# EasyEDA schematic RANGKAIAN SISTEM KESELURUHAN.json
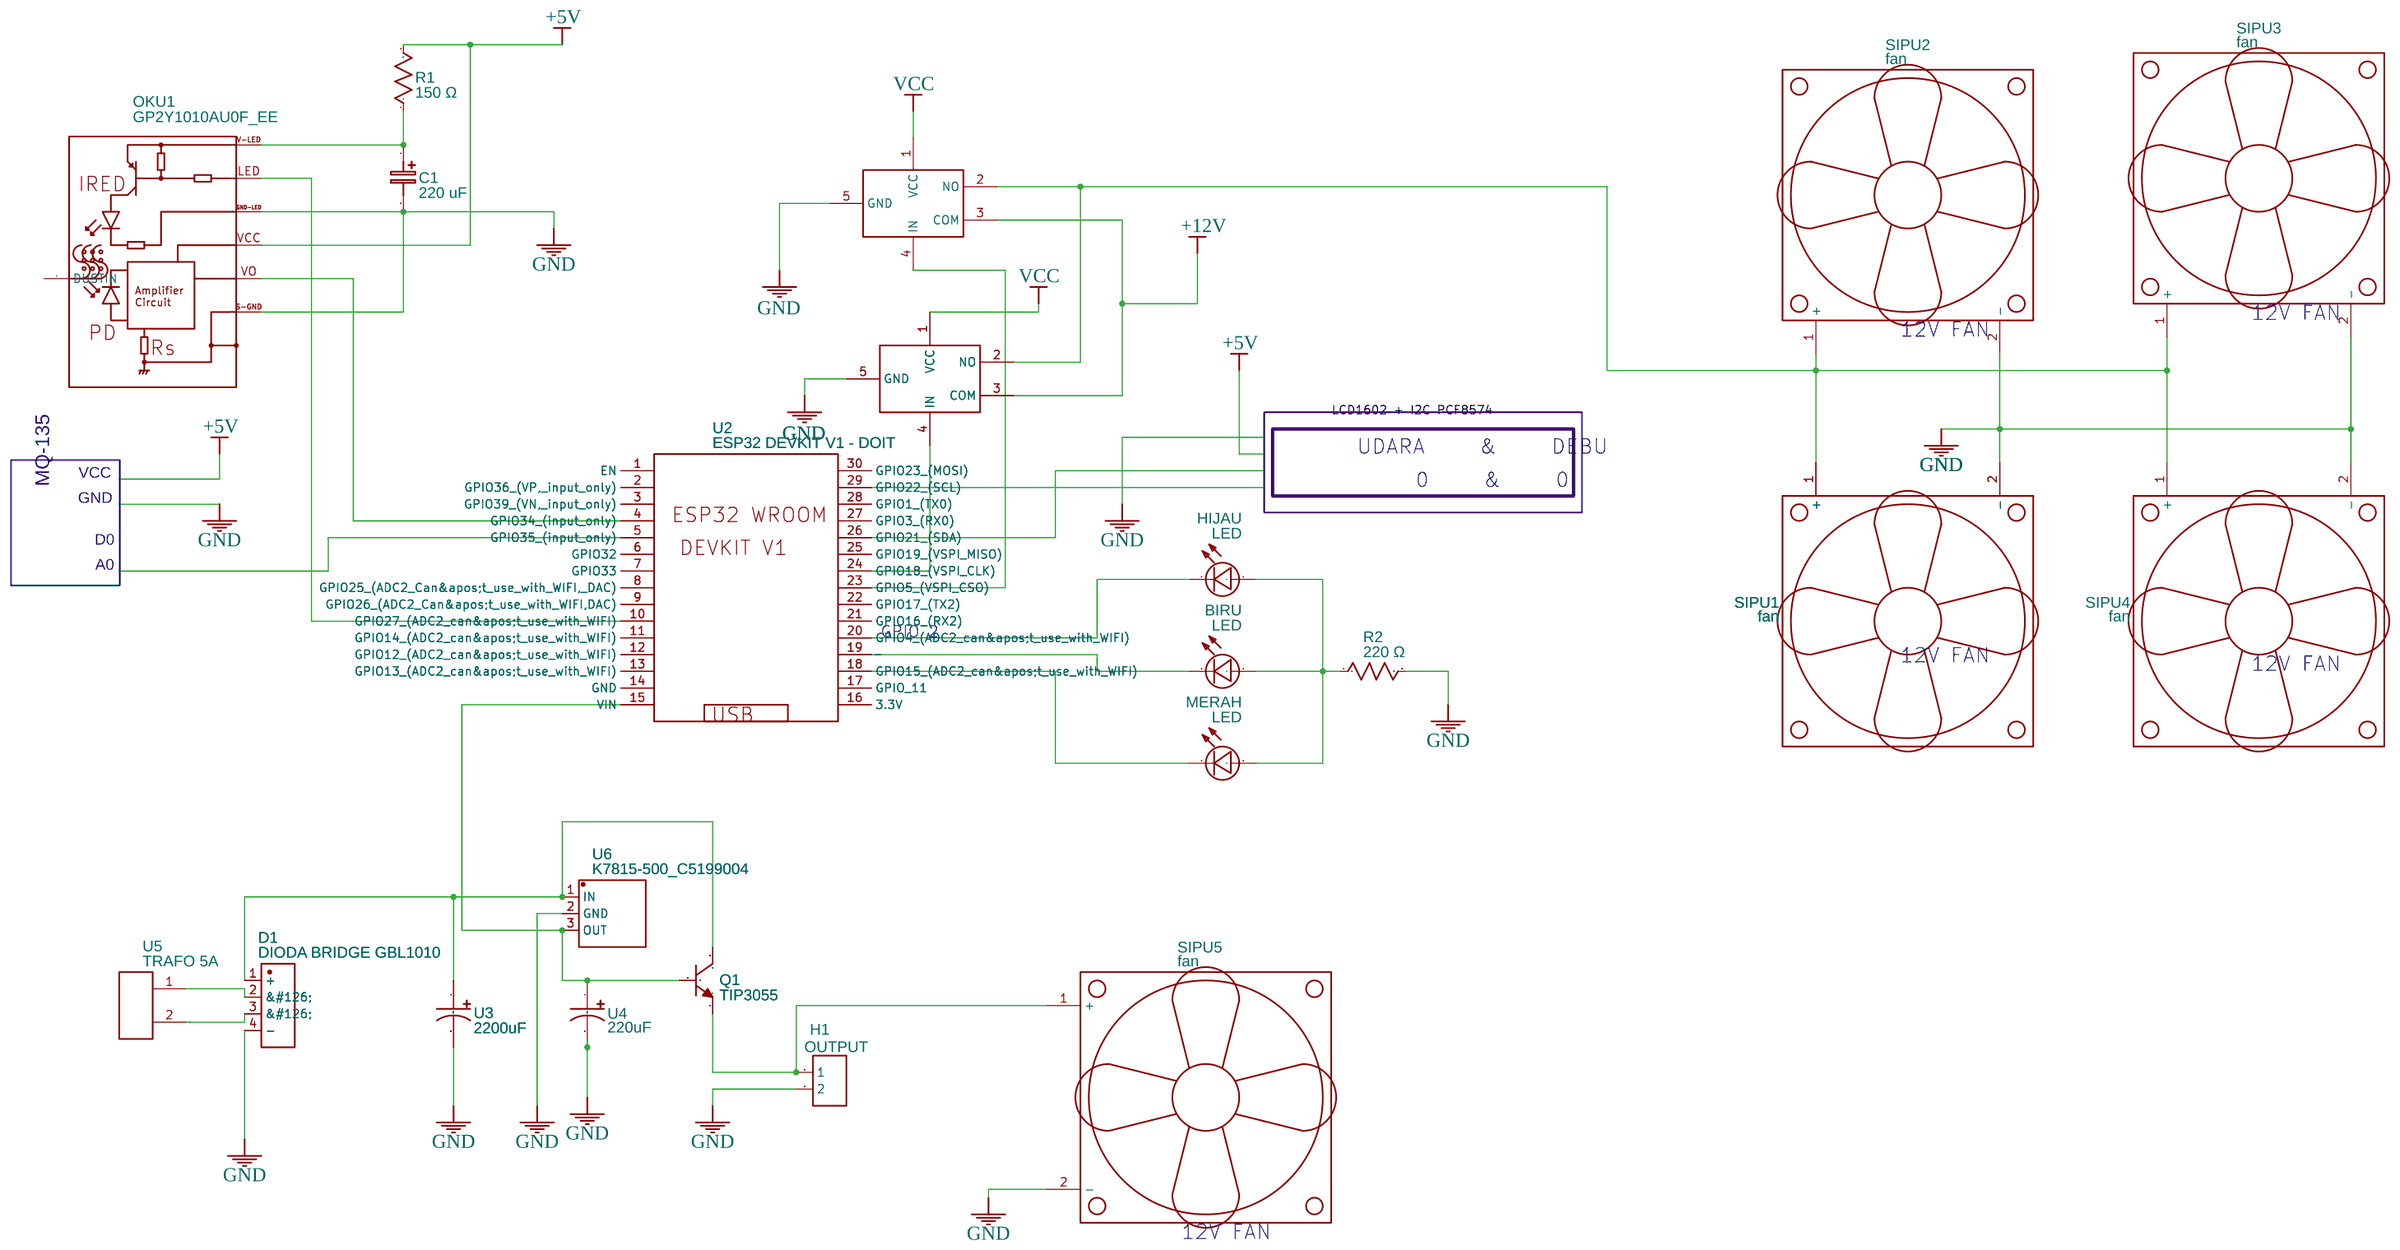
[diagram p0: schematic sheet]

## Parts
BIRU  LED  [LED0603_RED]
C1  220 uF  [CASE-A_3216]
D1  DIODA BRIDGE GBL1010  [GBU_4P-L22.0-W3.6-P5.08]
H1  OUTPUT  [HDR-F-2.54_1X2]
HIJAU  LED  [LED0603_RED]
MERAH  LED  [LED0603_RED]
OKU1  GP2Y1010AU0F_EE  [DIP8_400MIL_WIDEBODY]
Q1  TIP3055  [SOT-23-3_L2.9-W1.3-P1.90-LS2.4-TR]
R1  150 Ω  [R0603]
R2  220 Ω  [R0603]
SIPU1  fan  [FAN]
SIPU2  fan  [FAN]
SIPU3  fan  [FAN]
SIPU4  fan  [FAN]
SIPU5  fan  [FAN]
U1  Relay 5P  [RELAY-5P-DIP-19.0X15.2-H15-HF3FF]
U2  ESP32 DEVKIT V1 - DOIT  [ESP32 WROOM DEVKIT V1]
U3  2200uF  [CAP]
U4  220uF  [CAP]
U5  TRAFO 5A
U6  K7815-500_C5199004  [PWRM-TH_K7809-500]
U7  Relay 5P  [RELAY-5P-DIP-19.0X15.2-H15-HF3FF]

## Library data of the parts
BIRU HIJAU MERAH = LED: catid: 20; Contributor: 仿真库绘制; Color: Red; sim: true
C1 = C_Tan_SMD_A_EU: Contributor: LCEDA_Lib
D1 = Dioda Bridge 10A: Supplier: LCSC; Supplier Part: C525760; Manufacturer: GOODWORK; Manufacturer Part: GBU1010; Contributor: LCSC; JLCPCB Part Class: Extended Part
H1 = HDR-F-2.54_1x2: Supplier Part: C49661; Supplier: LCSC; Contributor: LCEDA_Lib
OKU1 = GP2Y1010AU0F_EE_IN DEVELOPMENT: catid: 20; sourceId: Gke7pjBhb; Manufacturer Part: ?
Q1 = 2N3904(SOT-23): Supplier: LCSC; Manufacturer: KEC; Manufacturer Part: 2n3904S-RTK/PS; Supplier Part: C18536; Paste Type: SOT-23; Contributor: LCEDA_Lib
R1 R2 = R_0603_US: Contributor: LCEDA_Lib
SIPU1-SIPU5 = -: Contributor: novasilisko; Manufacturer Part: ?; Package Display: No
U1 U7 = Relay 5P: Contributor: boefjim
U2 = ESP32 DEVKIT V1 - DOIT: Manufacturer: DOIT; Supplier: DOIT; link: https://randomnerdtutorials.com/esp32-pinout-reference-gpios/; Contributor: Shaun.M
U3 U4 = kapasitor: Contributor: ibrahimd
U5 = Kapasitor_yatik: Contributor: ta5lvc
U6 = K7809-500_C5199004: Supplier: LCSC; Supplier Part: C5199004; Manufacturer: JETEKPS(健特); Manufacturer Part: K7809-500; link: https://atta.szlcsc.com/upload/public/pdf/source/20221014/DB3860969D2EAB450E47D1551D4BEB4E.pdf; Contributor: lcsc

## Nets
+5V: OKU1.VCC R1.2
+12V: U1.3(COM) U7.3(COM)
GND: C1.2 D1.4(-) H1.2 OKU1.GND-LED(LEDGND) OKU1.S-GND(SGND) R2.2 SIPU1.2(-) SIPU2.2(-) SIPU3.2(-) SIPU4.2(-) SIPU5.2(-) U1.5(GND) U3.2 U4.2 U6.2(GND) U7.5(GND)
VCC: U1.1(VCC) U7.1(VCC)
Net-(BIRU-1): BIRU.1(+) HIJAU.1(+) MERAH.1(+) R2.1
Net-(BIRU-2): BIRU.2(-) U2.19(GPIO2 (ADC2 can't use with WIFI))
Net-(C1-1): C1.1 OKU1.V-LED(VLED) R1.1
Net-(D1-1): D1.1(+) Q1.3(C) U3.1 U6.1(IN)
Net-(H1-1): H1.1 Q1.1(E) SIPU5.1(+)
Net-(HIJAU-2): HIJAU.2(-) U2.20(GPIO4 (ADC2 can't use with WIFI))
Net-(MERAH-2): MERAH.2(-) U2.18(GPIO15 (ADC2 can't use with WIFI))
Net-(OKU1-LED): OKU1.LED U2.10(GPIO27 (ADC2 can't use with WIFI))
Net-(OKU1-VO): OKU1.VO U2.4(GPIO34 (input only))
Net-(Q1-2): Q1.2(B) U2.15(VIN) U4.1 U6.3(OUT)
Net-(SIPU1-1): SIPU1.1(+) SIPU2.1(+) SIPU3.1(+) SIPU4.1(+) U1.2(NO) U7.2(NO)
Net-(U1-4): U1.4(IN) U2.24(GPIO18 (VSPI CLK))
Net-(U2-23): U2.23(GPIO5 (VSPI CSO)) U7.4(IN)

Not connected (* = marked no-connect by the designer): D1 2(~) 3(~); OKU1 7(DUSTIN); U2 1(EN) 2(GPIO36 (VP, input only)) 3(GPIO39 (VN, input only)) 5(GPIO35 (input only)) 6(GPIO32) 7(GPIO33) 8(GPIO25 (ADC2 Can't use with WIFI, DAC)) 9(GPIO26 (ADC2 Can't use with WIFI,DAC)) 11(GPIO14 (ADC2 can't use with WIFI)) 12(GPIO12 (ADC2 can't use with WIFI)) 13(GPIO13 (ADC2 can't use with WIFI)) 14(GND) 16(3.3V) 17(GPIO 11) 21(GPIO16 (RX2)) 22(GPIO17 (TX2)) 25(GPIO19 (VSPI MISO)) 26(GPIO21 (SDA)) 27(GPIO3 (RX0)) 28(GPIO1 (TX0)) 29(GPIO22 (SCL)) 30(GPIO23 (MOSI)); U5 1(-) 2(+)

## Notes on the sheet
- 12V FAN
- 12V FAN
- UDARA     &     DEBU
- VCC
- MQ-135
- 0     &     0
- GND
- D0
- A0
- GPIO 2
- 12V FAN
- 12V FAN
- 12V FAN
